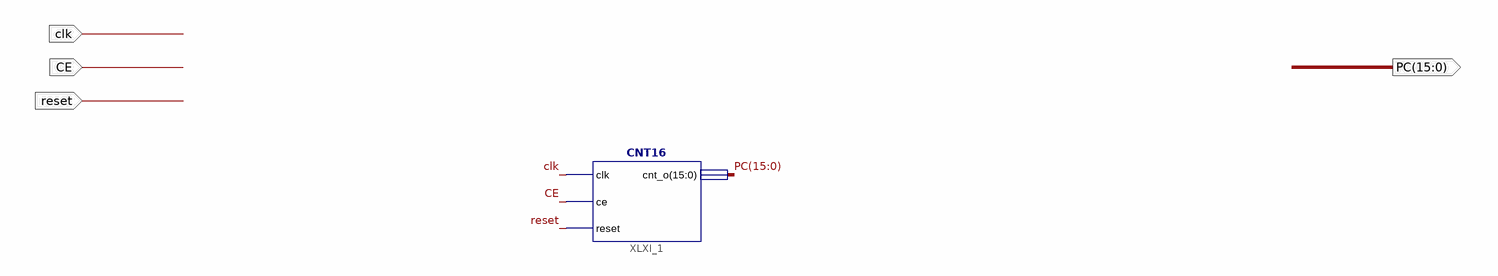
[diagram p0: schematic sheet 1]
// Xilinx ISE schematic Program_Counter.sch (spartan6) as structural Verilog: 1 symbols, 4 ports
module Program_Counter (
  input  clk,
  input  CE,
  input  reset,
  output [15:0] PC
);

  CNT16 XLXI_1 (.clk(clk), .ce(CE), .reset(reset), .cnt_o(PC));
endmodule
